# EAGLE schematic untitled (EAGLE 9.6.2)
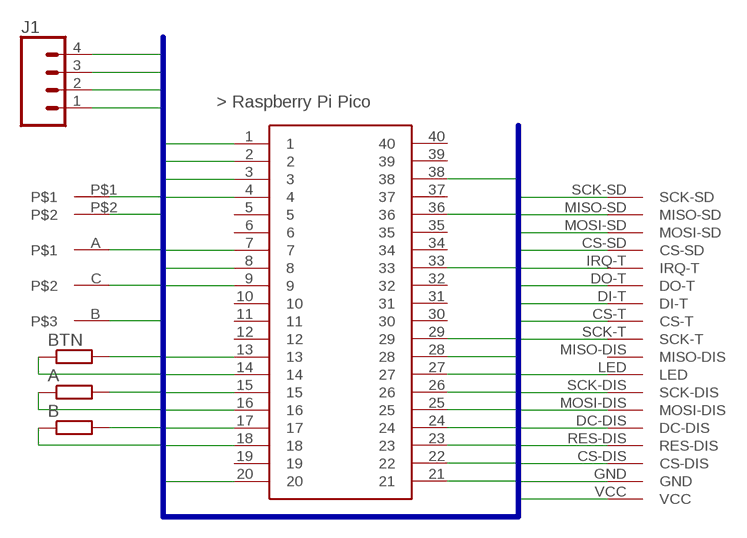
[diagram p0: schematic, sheet 1]

## Parts
A  R-EU_M0805  [M0805]
B  R-EU_M0805  [M0805]
BTN  R-EU_M0805  [M0805]
J1  CONN_04LOCK  [1X04_LOCK]
U$1  PICO  [PICO_TH]
U$2  RING_ENCODER  [EC25-RING-ENCODER]
U$3  ST7789  [TFT-2.8-SD]
U$4  3X6X4.3-BUTTON  [BTN-3X6X4.3]

## Nets
3V3: BTN.2 J1.1 U$1.36 U$3.LED U$3.VCC
A: A.1 U$1.9 U$2.A
B: B.1 U$1.7 U$2.B
BTN: BTN.1 U$1.4 U$4.P$1
D-CS: U$1.29 U$3.CS-DIS
D-DC: U$1.26 U$3.DC-DIS
D-RST: U$1.27 U$3.RES-DIS
GND: A.2 B.2 J1.2 U$1.3 U$1.8 U$1.13 U$1.18 U$1.23 U$1.28 U$1.33 U$1.38 U$2.C U$3.GND U$4.P$2
MISO: U$1.21 U$3.DO-T
MOSI: U$1.25 U$3.DI-T U$3.MOSI-DIS
RX: J1.3 U$1.2
SCK: U$1.24 U$3.SCK-DIS U$3.SCK-T
SD-CS: U$1.17 U$3.CS-SD
SD-MISO: U$1.16 U$3.MISO-SD
SD-MOSI: U$1.15 U$3.MOSI-SD
SD-SCK: U$1.14 U$3.SCK-SD
T-CS: U$1.22 U$3.CS-T
T-IRQ: U$1.20 U$3.IRQ-T
TX: J1.4 U$1.1
Unconnected: U$1.5 U$1.6 U$1.10 U$1.11 U$1.12 U$1.19 U$1.30 U$1.31 U$1.32 U$1.34 U$1.35 U$1.37 U$1.39 U$1.40 U$3.MISO-DIS

## Buses
3V3,A,B,BTN,C,D-CS,D-DC,D-RST,GND,LED,MISO,MOSI,RX,SCK,SD-CS,SD-MISO,SD-MOSI,SD-SCK,T-CS,T-IRQ,TX

## Library data of the parts
A B BTN = rcl:R-EU_: RESISTOR, European symbol; SPICEPREFIX: R
J1 = SparkFun-Connectors:CONN_04: Multi connection point. Often used as Generic Header-pin footprint for 0.1 inch spaced/style header connections On any of the 0.1 inch spaced packages, you can populate with these: Break Away Headers - Straight <https://www.sparkfun.com/products/116> (PRT-00116) Break Away Male Headers - Right Angle <https://www.sparkfun.com/products/553> (PRT-00553) Female Headers <https://www.sparkfun.com/products/115> (PRT-00115) Break Away Headers - Machine Pin <https://www.sparkfun.com/products/117> (PRT-00117) Break Away Female Headers - Swiss Machine Pin <https://www.sparkfun.com/products/743> (PRT-00743) For SCREWTERMINALS and SPRING TERMINALS visit here: Screw Terimnals on SparkFun.com <https://www.sparkfun.com/search/results?term=Screw+Terminals> (5mm/3.5mm/2.54mm spacing) This device is also useful as a general connection point to wire up your design to another part of your project. Our various solder wires solder well into these plated through hole pads. Hook-Up Wire - Assortment (Stranded, 22 AWG) <https://www.sparkfun.com/products/11375> (PRT-11375) Hook-Up Wire - Assortment (Solid Core, 22 AWG) <https://www.sparkfun.com/products/11367> (PRT-11367) View the entire wire category on our website here <https://www.sparkfun.com/categories/141> Special notes: Molex polarized connector foot print use with SKU : PRT-08231 with associated crimp pins and housings. 1MM SMD Version SKU: PRT-10208; PROD_ID: CONN-09696
U$1 = pipico:PICO
U$2 = userlib:RING_ENCODER
U$3 = adafruit:ST7789
U$4 = buttons:3X6X4.3-BUTTON